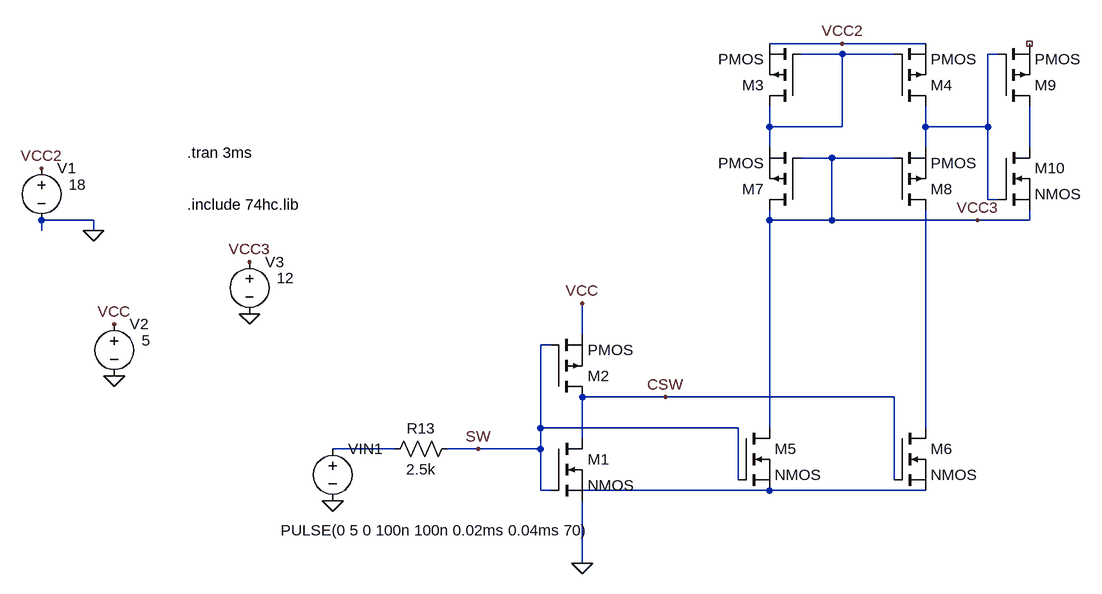
[diagram p0: schematic Draft56.asc]
Draft56.asc, the LTspice schematic file:
Version 4
SHEET 1 2756 1020
WIRE 1104 -288 992 -288
WIRE 1232 -288 1104 -288
WIRE 1104 -272 1040 -272
WIRE 1184 -272 1104 -272
WIRE 1344 -272 1328 -272
WIRE 992 -160 992 -192
WIRE 1104 -160 1104 -272
WIRE 1104 -160 992 -160
WIRE 1232 -160 1232 -192
WIRE 1328 -160 1328 -272
WIRE 1328 -160 1232 -160
WIRE 992 -128 992 -160
WIRE 1232 -128 1232 -160
WIRE 1392 -128 1392 -192
WIRE 1088 -112 1040 -112
WIRE 1184 -112 1088 -112
WIRE 1328 -48 1328 -160
WIRE 1344 -48 1328 -48
WIRE -48 -16 -128 -16
WIRE 992 -16 992 -32
WIRE 1088 -16 1088 -112
WIRE 1088 -16 992 -16
WIRE 1312 -16 1088 -16
WIRE 1392 -16 1392 -32
WIRE 1392 -16 1312 -16
WIRE -128 0 -128 -16
WIRE -48 0 -48 -16
WIRE 704 160 704 112
WIRE 656 176 640 176
WIRE 832 256 704 256
WIRE 1184 256 832 256
WIRE 640 304 640 176
WIRE 944 304 640 304
WIRE 992 304 992 -16
WIRE 1232 304 1232 -32
WIRE 704 320 704 256
WIRE 416 336 320 336
WIRE 544 336 496 336
WIRE 640 336 640 304
WIRE 640 336 544 336
WIRE 944 384 944 304
WIRE 1184 384 1184 256
WIRE 640 400 640 336
WIRE 656 400 640 400
WIRE 992 400 704 400
WIRE 1232 400 992 400
WIRE 704 512 704 416
FLAG -48 0 0
FLAG -128 -96 VCC2
FLAG 544 336 SW
FLAG 320 416 0
FLAG 832 256 CSW
FLAG 704 512 0
FLAG -16 224 0
FLAG -16 144 VCC
FLAG 704 112 VCC
FLAG 1104 -288 VCC2
FLAG 192 48 VCC3
FLAG 192 128 0
FLAG 1312 -16 VCC3
SYMBOL voltage -128 -112 R0
WINDOW 123 0 0 Left 0
WINDOW 39 0 0 Left 0
WINDOW 3 42 41 Left 2
SYMATTR Value 18
SYMATTR InstName V1
SYMBOL voltage 320 320 R0
WINDOW 123 0 0 Left 0
WINDOW 39 0 0 Left 0
WINDOW 3 -80 141 Left 2
SYMATTR Value PULSE(0 5 0 100n 100n 0.02ms 0.04ms 70)
SYMATTR InstName VIN1
SYMBOL res 512 320 R90
WINDOW 0 0 56 VBottom 2
WINDOW 3 32 56 VTop 2
SYMATTR InstName R13
SYMATTR Value 2.5k
SYMBOL nmos 656 320 R0
SYMATTR InstName M1
SYMBOL pmos 656 256 M180
SYMATTR InstName M2
SYMBOL voltage -16 128 R0
WINDOW 123 0 0 Left 0
WINDOW 39 0 0 Left 0
WINDOW 3 42 41 Left 2
SYMATTR Value 5
SYMATTR InstName V2
SYMBOL pmos 1040 -192 R180
SYMATTR InstName M3
SYMBOL pmos 1184 -192 M180
SYMATTR InstName M4
SYMBOL nmos 944 304 R0
SYMATTR InstName M5
SYMBOL nmos 1184 304 R0
SYMATTR InstName M6
SYMBOL pmos 1040 -32 R180
SYMATTR InstName M7
SYMBOL pmos 1184 -32 M180
SYMATTR InstName M8
SYMBOL pmos 1344 -192 M180
SYMATTR InstName M9
SYMBOL nmos 1344 -128 R0
SYMATTR InstName M10
SYMBOL voltage 192 32 R0
WINDOW 123 0 0 Left 0
WINDOW 39 0 0 Left 0
WINDOW 3 42 41 Left 2
SYMATTR Value 12
SYMATTR InstName V3
TEXT 96 -120 Left 2 !.tran 3ms
TEXT 96 -40 Left 2 !.include 74hc.lib

The netlist it stands for:
* Draft56.asc
V1 VCC2 0 18
VIN1 N005 0 PULSE(0 5 0 100n 100n 0.02ms 0.04ms 70)
R13 SW N005 2.5k
M1 CSW SW 0 0 NMOS
M2 CSW SW VCC VCC PMOS
V2 VCC 0 5
M3 N001 N001 VCC2 VCC2 PMOS
M4 N002 N001 VCC2 VCC2 PMOS
M5 VCC3 SW N006 N006 NMOS
M6 N004 CSW N006 N006 NMOS
M7 VCC3 VCC3 N001 N001 PMOS
M8 N004 VCC3 N002 N002 PMOS
M9 N003 N002 NC_01 NC_01 PMOS
M10 N003 N002 VCC3 VCC3 NMOS
V3 VCC3 0 12
.model NMOS NMOS
.model PMOS PMOS
.lib standard.mos
.tran 3ms
.include 74hc.lib
.backanno
.end